# Altium schematic sheet robot rev4.SchDoc
size A2; PageSetup: Record=PageOptions|CenterHorizontal=True|CenterVertical=True|PrintScale=0.52|XCorrection=1.00|YCorrection=1.00|PrintKind=0|BorderSize=5000000|LeftOffset=0|BottomOffset=0|Orientation=2|PaperLength=1000|PaperWidth=1000|Scale=100|PaperSource=7|PrintQuality=-4|MediaType=1|DitherType=10|PaperKind=A4|PrintScaleMode=1
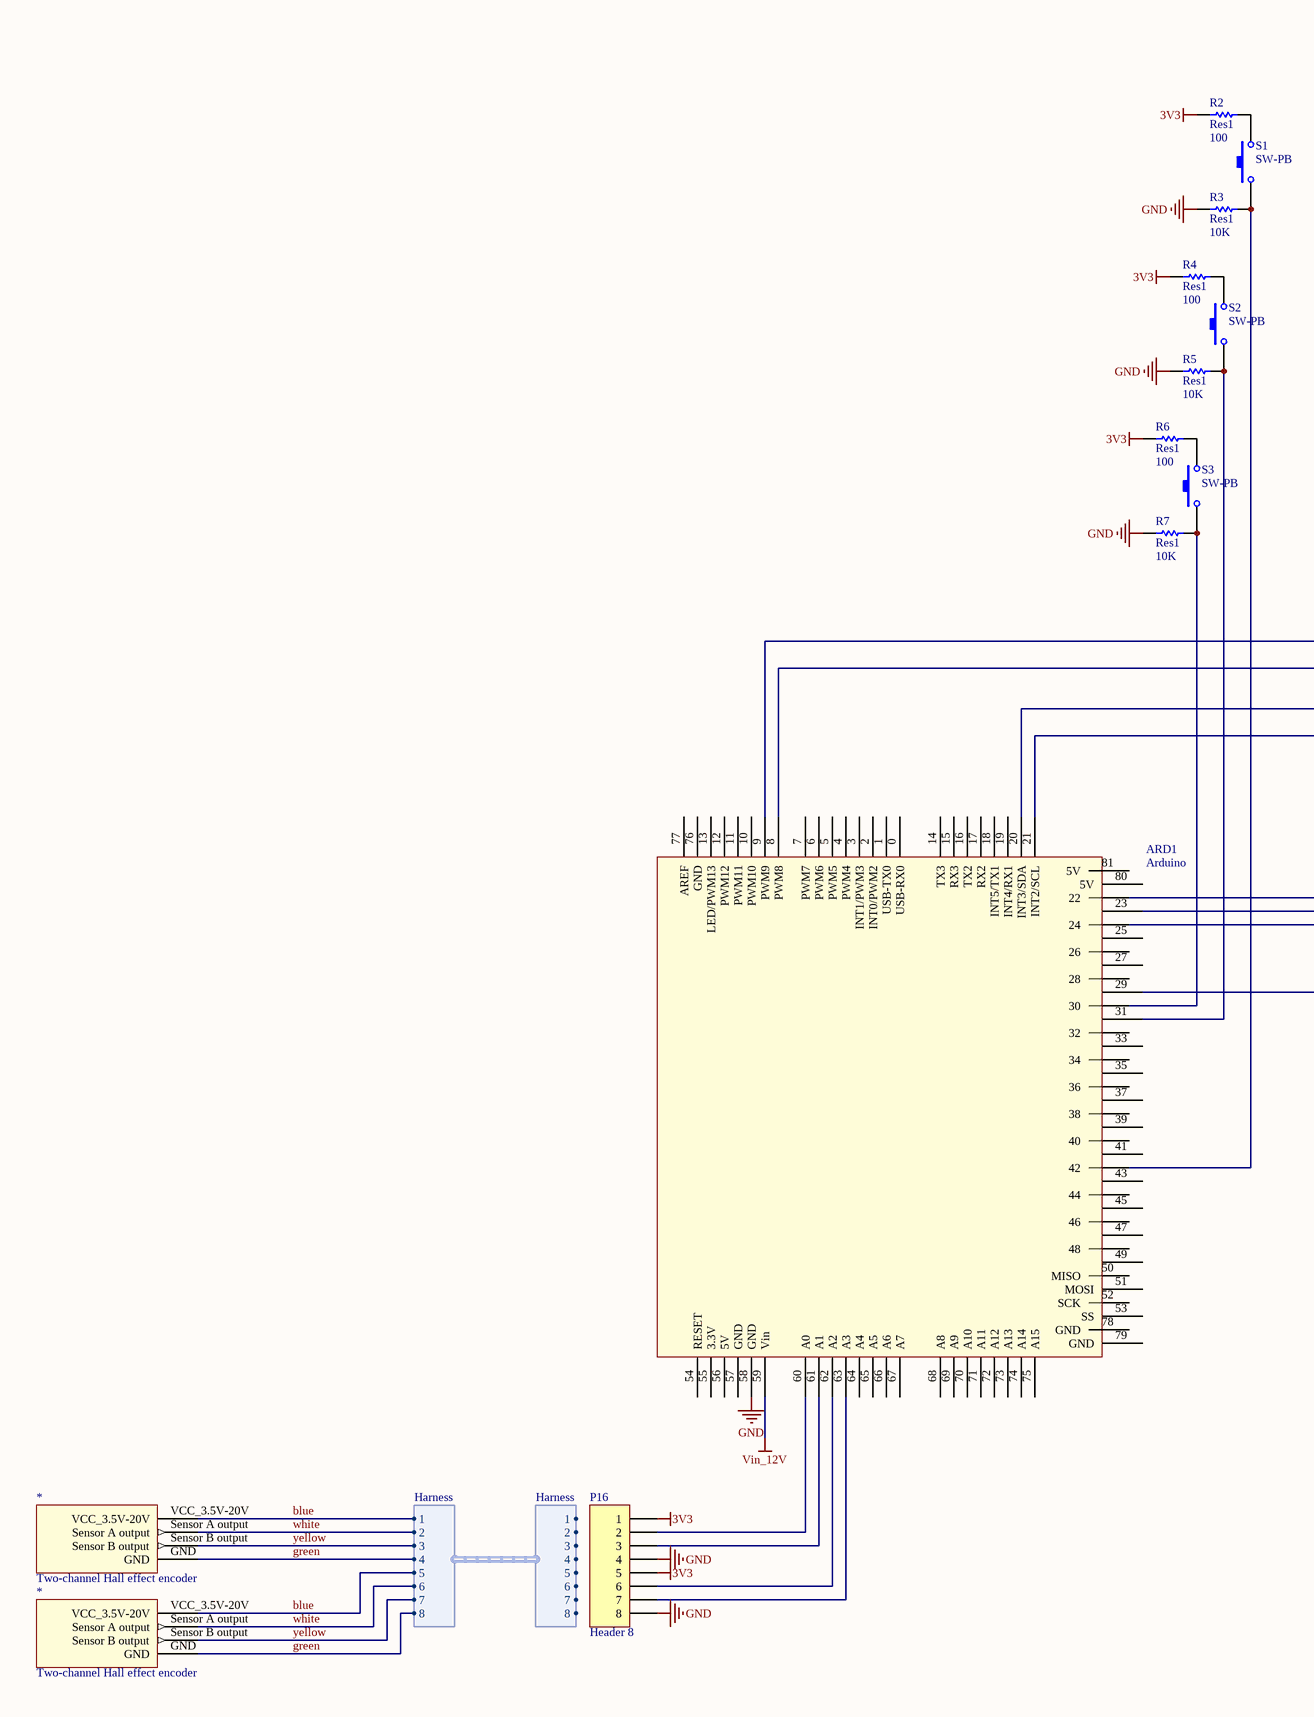
[diagram p0: robot rev4.SchDoc, left]
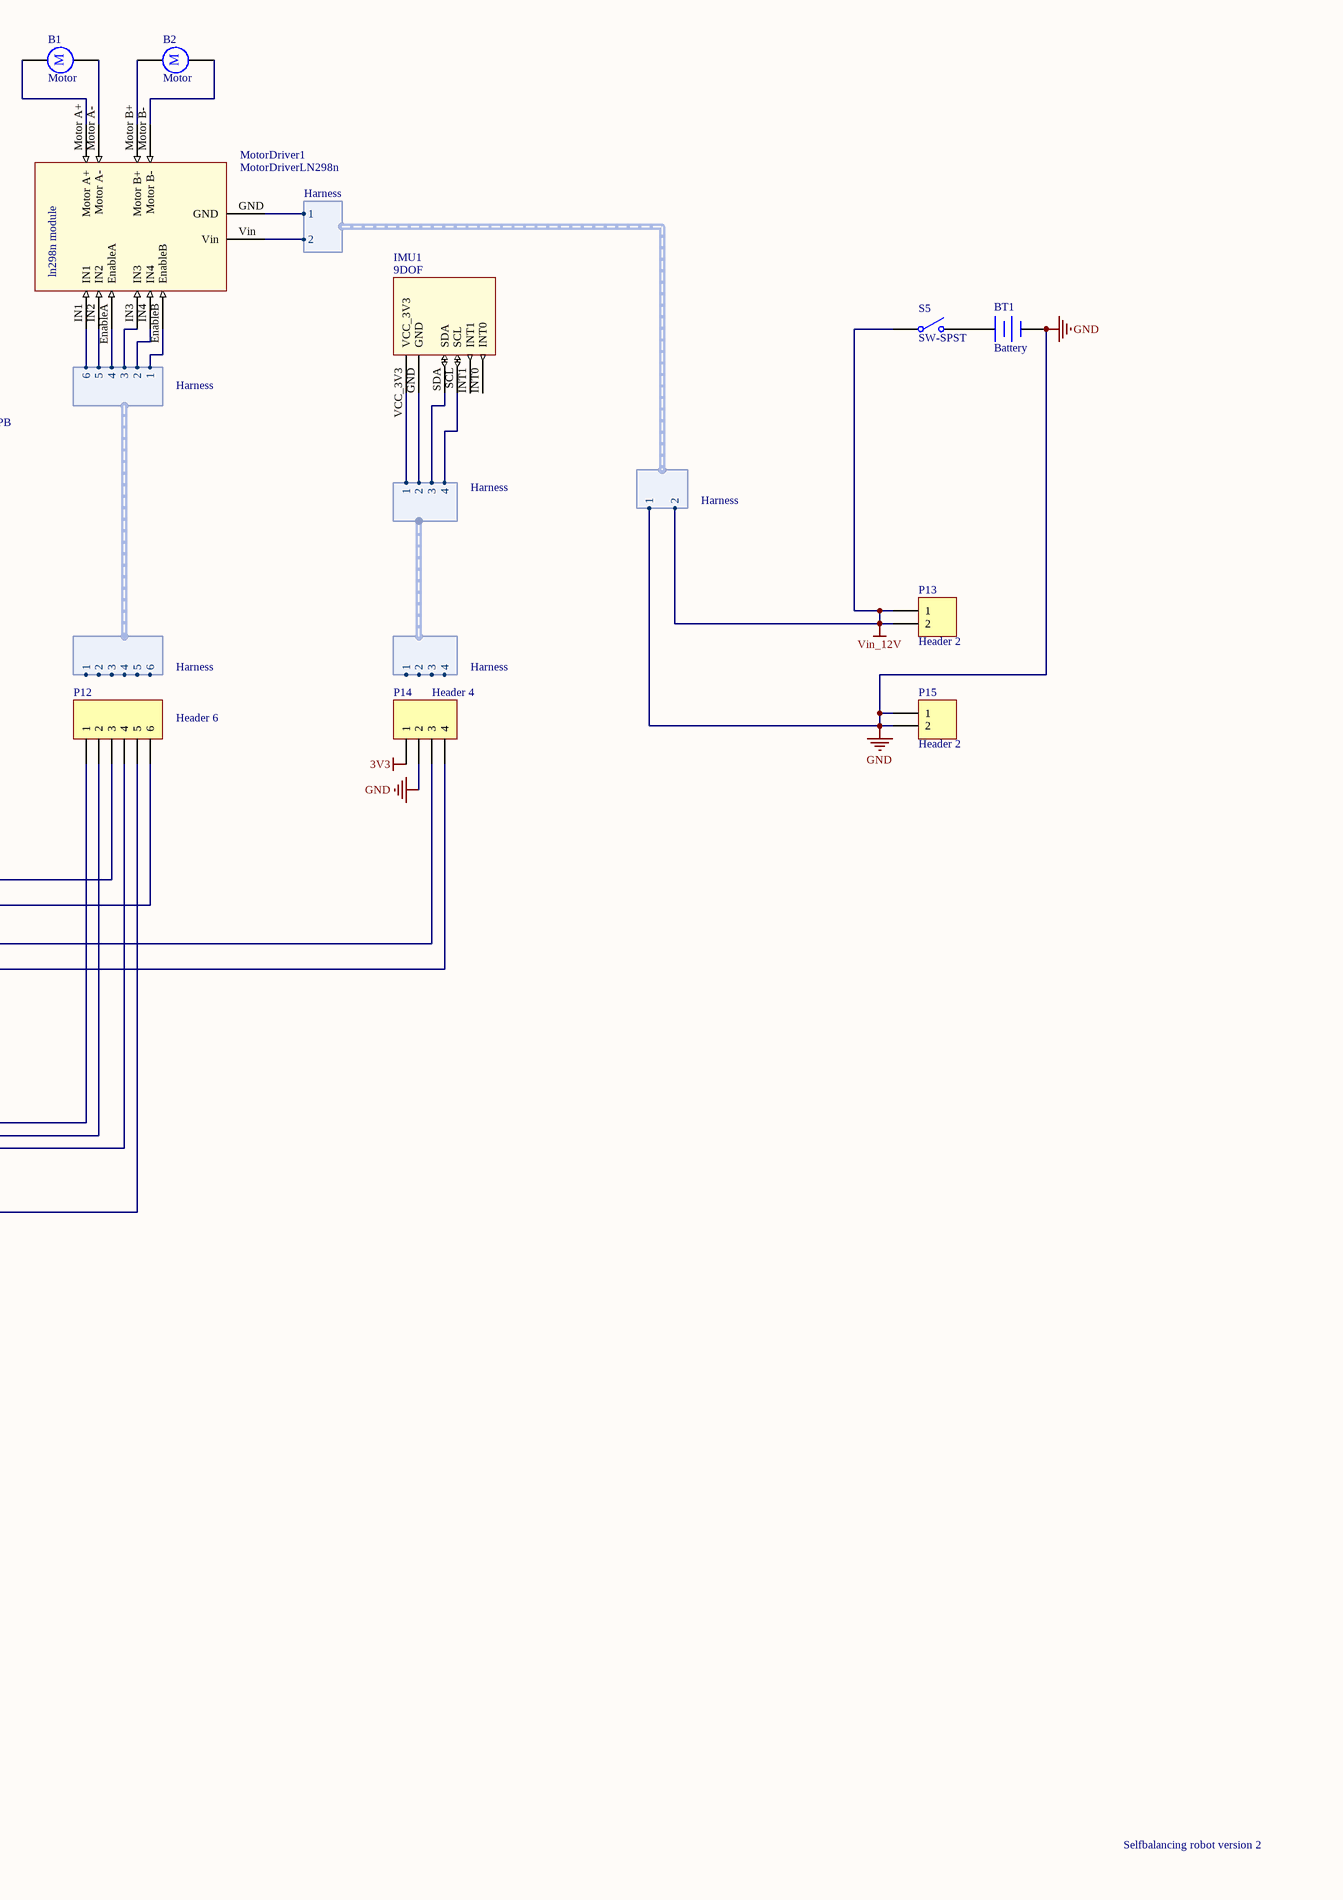
[diagram p1: robot rev4.SchDoc, right]

## Parts
(Parts that share a designator on the sheet are numbered #1, #2 ... from top to bottom, then left to right.)
*#1  Two-channel Hall effect encoder
*#2  Two-channel Hall effect encoder
ARD1  Arduino  [Arduino]
B1  Motor  [RB5-10.5]
B2  Motor  [RB5-10.5]
BT1  Battery  [BAT-2]
IMU1  9DOF
MotorDriver1  MotorDriverLN298n
P12  Header 6  [HDR1X6]
P13  Header 2  [HDR1X2]
P14  Header 4  [HDR1X4]
P15  Header 2  [HDR1X2]
P16  Header 8  [HDR1X8]
R2  Res1  value 100  [AXIAL-0.3]
R3  Res1  value 10K  [AXIAL-0.3]
R4  Res1  value 100  [AXIAL-0.3]
R5  Res1  value 10K  [AXIAL-0.3]
R6  Res1  value 100  [AXIAL-0.3]
R7  Res1  value 10K  [AXIAL-0.3]
S1  SW-PB  [SPST-2]
S2  SW-PB  [SPST-2]
S3  SW-PB  [SPST-2]
S5  SW-SPST  [SPST-2]

## Harnesses
Harness: 1, 2, 3, 4, 5, 6
Harness: 1, 2, 3, 4
Harness: 1, 2, 3, 4, 5, 6, 7, 8
Harness: 1, 2

## Nets
3V3: P14.1 P16.1 P16.5 R2.2 R4.2 R6.2
GND: ARD1.58(GND) BT1.2(-) MotorDriver1.GND P14.2 P15.1 P15.2 P16.4 P16.8 R3.1 R5.1 R7.1 ; harness Harness.1
Vin_12V: ARD1.59(Vin) MotorDriver1.Vin P13.1 P13.2 S5.1(COMMON) ; harness Harness.2
blue: *#1.VCC_3.5V-20V *#2.VCC_3.5V-20V ; harness Harness.1, harness Harness.5
green: *#1.GND *#2.GND ; harness Harness.4, harness Harness.8
white: *#1.Sensor_A_output *#2.Sensor_A_output ; harness Harness.2, harness Harness.6
yellow: *#1.Sensor_B_output *#2.Sensor_B_output ; harness Harness.3, harness Harness.7
NetARD1_8: ARD1.8(PWM8) P12.6
NetARD1_9: ARD1.9(PWM9) P12.3
NetARD1_20: ARD1.20(INT3/SDA) P14.3
NetARD1_21: ARD1.21(INT2/SCL) P14.4
NetARD1_22: ARD1.22 P12.1
NetARD1_23: ARD1.23 P12.2
NetARD1_24: ARD1.24 P12.4
NetARD1_29: ARD1.29 P12.5
NetARD1_30: ARD1.30 R7.2 S3.1
NetARD1_31: ARD1.31 R5.2 S2.1
NetARD1_42: ARD1.42 R3.2 S1.1
NetARD1_60: ARD1.60(A0) P16.2
NetARD1_61: ARD1.61(A1) P16.3
NetARD1_62: ARD1.62(A2) P16.6
NetARD1_63: ARD1.63(A3) P16.7
NetB1_1: B1.1 MotorDriver1.Motor_A+
NetB1_2: B1.2 MotorDriver1.Motor_A-
NetB2_1: B2.1 MotorDriver1.Motor_B+
NetB2_2: B2.2 MotorDriver1.Motor_B-
NetBT1_1: BT1.1(+) S5.2(NO)
NetIMU1_GND: IMU1.GND ; harness Harness.2
NetIMU1_SCL: IMU1.SCL ; harness Harness.4
NetIMU1_SDA: IMU1.SDA ; harness Harness.3
NetIMU1_VCC_3V3: IMU1.VCC_3V3 ; harness Harness.1
NetMotorDriver1_EnableA: MotorDriver1.EnableA ; harness Harness.4
NetMotorDriver1_EnableB: MotorDriver1.EnableB ; harness Harness.1
NetMotorDriver1_IN1: MotorDriver1.IN1 ; harness Harness.6
NetMotorDriver1_IN2: MotorDriver1.IN2 ; harness Harness.5
NetMotorDriver1_IN3: MotorDriver1.IN3 ; harness Harness.3
NetMotorDriver1_IN4: MotorDriver1.IN4 ; harness Harness.2
NetR2_1: R2.1 S1.2
NetR4_1: R4.1 S2.2
NetR6_1: R6.1 S3.2

Not connected (* = marked no-connect by the designer): ARD1 0(USB-RX0) 1(USB-TX0) 2(INT0/PWM2) 3(INT1/PWM3) 4(PWM4) 5(PWM5) 6(PWM6) 7(PWM7) 10(PWM10) 11(PWM11) 12(PWM12) 13(LED/PWM13) 14(TX3) 15(RX3) 16(TX2) 17(RX2) 18(INT5/TX1) 19(INT4/RX1) 25 26 27 28 32 33 34 35 36 37 38 39 40 41 43 44 45 46 47 48 49 50(MISO) 51(MOSI) 52(SCK) 53(SS) 54(RESET) 55(3.3V) 56(5V) 57(GND) 64(A4) 65(A5) 66(A6) 67(A7) 68(A8) 69(A9) 70(A10) 71(A11) 72(A12) 73(A13) 74(A14) 75(A15) 76(GND) 77(AREF) 78(GND) 79(GND) 80(5V) 81(5V); IMU1 INT0 INT1

## Notes on the sheet
- Selfbalancing robot version 2
- (in symbol Motor) M
- (in symbol MotorDriverLN298n) ln298n module

## Library data of the parts
B1 B2 = Motor: Motor, General Kind; Published: 24-Mar-1999; LatestRevisionDate: 17-Jul-2002; LatestRevisionNote: Re-released for DXP Platform.; PackageReference: RB5-10.5; Publisher: Altium Limited; PackageDescription: Capacitor (Radial); 2 Leads
BT1 = Battery: Multicell Battery; Published: 24-Mar-1999; LatestRevisionDate: 17-Jul-2002; LatestRevisionNote: Re-released for DXP Platform.; PackageReference: BAT-2; Publisher: Altium Limited; PackageDescription: Battery; 2 Leads
IMU1 = Sparkfun 6DOF I2C
MotorDriver1 = MotorDriverLN298n: Motor driver module ln298n
P12 = Header 6: Header, 6-Pin; LatestRevisionDate: 17-Jul-2002; LatestRevisionNote: Re-released for DXP Platform.; Publisher: Altium Limited
P13 P15 = Header 2: Header, 2-Pin; LatestRevisionDate: 17-Jul-2002; LatestRevisionNote: Re-released for DXP Platform.; Publisher: Altium Limited
P14 = Header 4: Header, 4-Pin; LatestRevisionDate: 17-Jul-2002; LatestRevisionNote: Re-released for DXP Platform.; Publisher: Altium Limited
P16 = Header 8: Header, 8-Pin; LatestRevisionDate: 17-Jul-2002; LatestRevisionNote: Re-released for DXP Platform.; Publisher: Altium Limited
R2-R7 = Res1: Resistor; Published: 8-Jun-2000; LatestRevisionDate: 17-Jul-2002; LatestRevisionNote: Re-released for DXP Platform.; PackageReference: AXIAL-0.3; Publisher: Altium Limited; PackageDescription: Axial Device, Thru-Hole; 2 Leads; 0.3 in Pin Spacing
S1-S3 = SW-PB: Switch; Published: 24-Mar-1999; LatestRevisionDate: 17-Jul-2002; LatestRevisionNote: Re-released for DXP Platform.; PackageReference: SPST-2; Publisher: Altium Limited; PackageDescription: Switch; 2 Leads
S5 = SW-SPST: Single-Pole, Single-Throw Switch; Published: 24-Mar-1999; LatestRevisionDate: 17-Jul-2002; LatestRevisionNote: Re-released for DXP Platform.; PackageReference: SPST-2; Publisher: Altium Limited; PackageDescription: Switch; 2 Leads